# EAGLE design lego dc converter (EAGLE 5.12)
BOM: EXCLUDE; DATABASE: ../../partsdb.txt; PARTNO: CRGH1206J470K
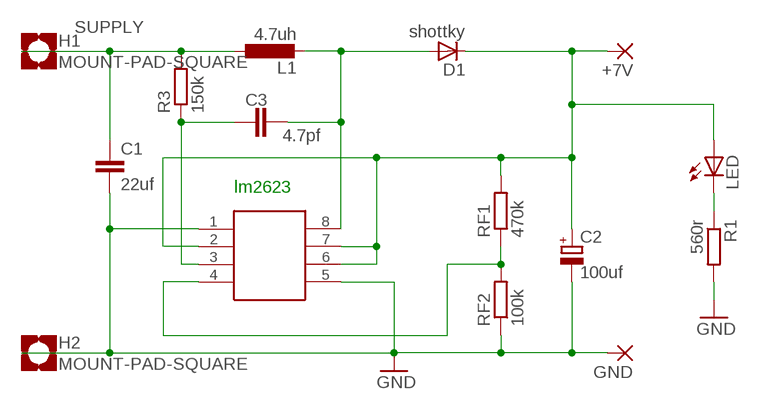
[diagram p0: schematic, sheet 1]

## Parts
+7V  3,17/1,1  [3,17/1,1]
C1  22uf  C-EUC1206  [C1206]
C2  100uf  CPOL-EUC/6032-28R  [C/6032-28R]
C3  4.7pf  C-EUC1206  [C1206]
D1  shottky  BYS10  [SOD106A]
GND  3,17/1,1  [3,17/1,1]
H1  MOUNT-PAD-SQUARE  [FUELCELL]
H2  MOUNT-PAD-SQUARE  [FUELCELL]
L1  4.7uh  L-EUL5050  [L5050]
LED  LEDSMT1206  [1206]
LM2623  lm2623  MINI-SO  [MINI-SO]
R1  560r  R-EU_M1206  [M1206]
R3  150k  R-EU_M1206  [M1206]
RF1  470k  R-EU_M1206  [M1206]
RF2  100k  R-EU_M1206  [M1206]

## Nets
GND: C1.2 C2.- GND.1(P) H2.P$1(MOUNT) LM2623.1 LM2623.5 R1.2 RF2.1
N$1: C3.1 LM2623.3 R3.1
N$3: LM2623.4 RF1.1 RF2.2
N$16: LED.C R1.1
OUT [supply]: +7V.1(P) C2.+ D1.K LED.A LM2623.2 LM2623.6 LM2623.7 RF1.2
SUPPLY: C1.1 H1.P$1(MOUNT) L1.1 R3.2
SWITCH [supply]: C3.2 D1.A L1.2 LM2623.8

## Notes on the sheet
- lm2623

## Library data of the parts
+7V GND = wirepad:3,17/1,1: THROUGH-HOLE PAD
C1 = resistor:C-EU: CAPACITOR, European symbol
C2 = rcl:CPOL-EU: POLARIZED CAPACITOR, European symbol
C3 = matt rcl:C-EU: CAPACITOR, European symbol
D1 = telefunken:BYS10: DIODE
H1 H2 = holes:MOUNT-PAD-SQUARE: MOUNTING PAD, square
L1 = matt rcl:L-EU: INDUCTOR, European symbol
LED = matt led:LED: LED OSRAM: - CHIPLED LG R971, LG N971, LY N971, LG Q971, LY Q971, LO R971, LY R971 LH N974, LH R974 LS Q976, LO Q976, LY Q976 LO Q996 - Hyper CHIPLED LW Q18S LB Q993, LB Q99A, LB R99A - SideLED LS A670, LO A670, LY A670, LG A670, LP A670 LB A673, LV A673, LT A673, LW A673 LH A674 LY A675 LS A676, LA A676, LO A676, LY A676, LW A676 LS A679, LY A679, LG A679 - Hyper Micro SIDELED® LS Y876, LA Y876, LO Y876, LY Y876 LT Y87S - SmartLED LW L88C, LW L88S LB L89C, LB L89S, LG L890 LS L89K, LO L89K, LY L89K LS L896, LA L896, LO L896, LY L896 - TOPLED LS T670, LO T670, LY T670, LG T670, LP T670 LSG T670, LSP T670, LSY T670, LOP T670, LYG T670 LG T671, LOG T671, LSG T671 LB T673, LV T673, LT T673, LW T673 LH T674 LS T676, LA T676, LO T676, LY T676, LB T676, LH T676, LSB T676, LW T676 LB T67C, LV T67C, LT T67C, LS T67K, LO T67K, LY T67K, LW E67C LS E67B, LA E67B, LO E67B, LY E67B, LB E67C, LV E67C, LT E67C LW T67C LS T679, LY T679, LG T679 LS T770, LO T770, LY T770, LG T770, LP T770 LB T773, LV T773, LT T773, LW T773 LH T774 LS E675, LA E675, LY E675, LS T675 LS T776, LA T776, LO T776, LY T776, LB T776 LHGB T686 LT T68C, LB T68C - Hyper Mini TOPLED® LB M676 - Mini TOPLED Santana® LG M470 LS M47K, LO M47K, LY M47K Source: http://www.osram.convergy.de LUXEON: - LUMILED® LXK2-PW12-R00, LXK2-PW12-S00, LXK2-PW14-U00, LXK2-PW14-V00 LXK2-PM12-R00, LXK2-PM12-S00, LXK2-PM14-U00 LXK2-PE12-Q00, LXK2-PE12-R00, LXK2-PE12-S00, LXK2-PE14-T00, LXK2-PE14-U00 LXK2-PB12-K00, LXK2-PB12-L00, LXK2-PB12-M00, LXK2-PB14-N00, LXK2-PB14-P00, LXK2-PB14-Q00 LXK2-PR12-L00, LXK2-PR12-M00, LXK2-PR14-Q00, LXK2-PR14-R00 LXK2-PD12-Q00, LXK2-PD12-R00, LXK2-PD12-S00 LXK2-PH12-R00, LXK2-PH12-S00 LXK2-PL12-P00, LXK2-PL12-Q00, LXK2-PL12-R00 Source: www.luxeon.com KINGBRIGHT: KA-3528ASYC Source: www.kingbright.com
LM2623 = matt smd-special:MINI-SO: Mini-SO generic format
R1 R3 RF1 RF2 = resistor:R-EU_: RESISTOR, European symbol

## Net classes
1 supply: width 0.508 mm

## Board
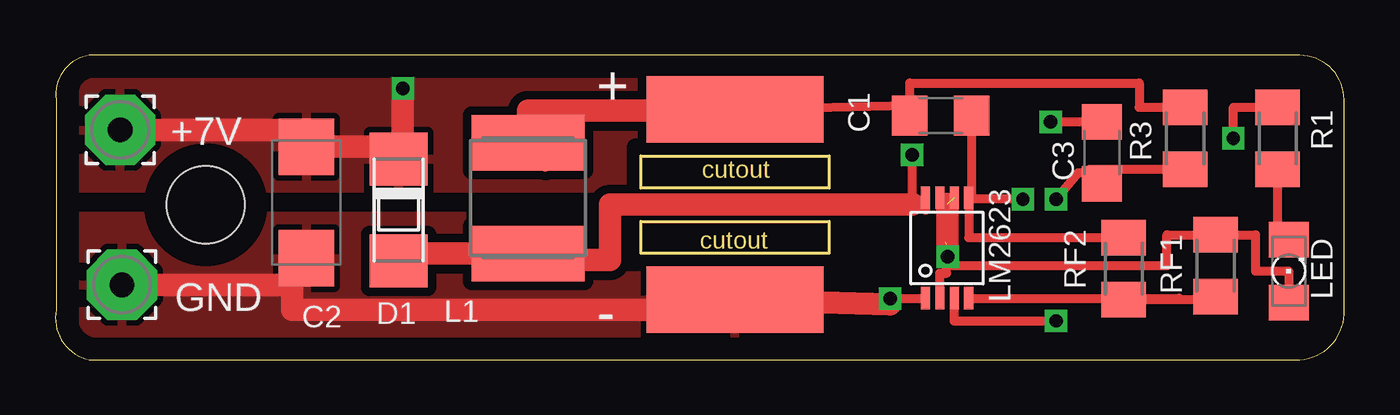
[diagram p1: board, top side]
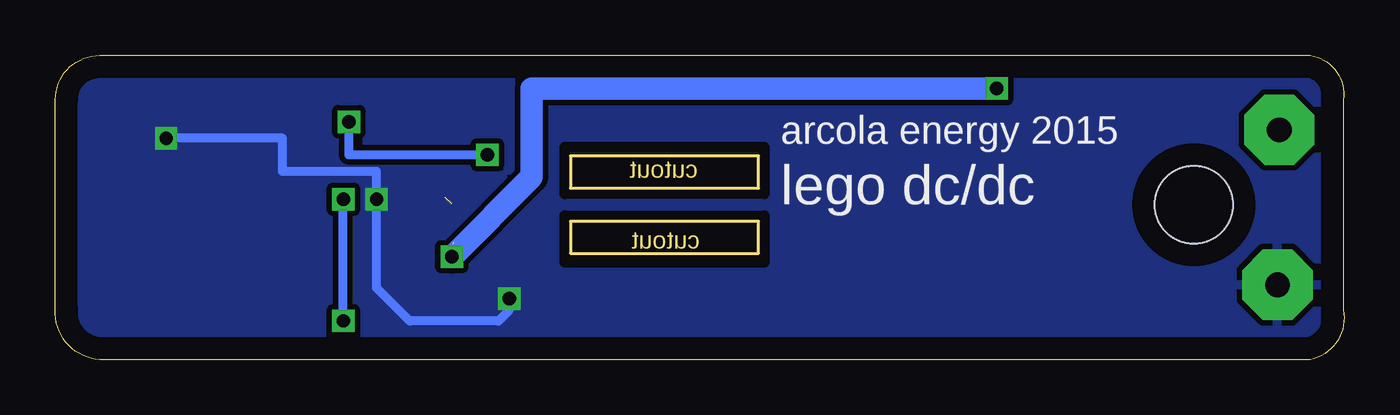
[diagram p2: board, bottom side, seen from below]

Size 58.19 x 13.75 mm. Coordinates in mm from the lower left corner, seen from the top.
Outline: 58.19,11.75 arc90 56.19,13.75 1.54,13.75 arc90 0.04,11.75 0.04,2.25 arc90 1.54,0 56.19,0 arc90 58.19,2.25 58.19,11.75
Copper layers (1*16): Top 0.035mm / dielectric 1.5mm / Bottom 0.035mm
Design rules "default": minimum track width 10mil, minimum drill 24mil, track to track 8mil, track to pad 8mil, pad to pad 8mil, via to via 8mil, smd to smd 8mil, copper to edge 40mil, drill to drill 8mil, minimum pad ring 10mil, minimum via ring 8mil, stop-mask expansion 4mil, vias tented up to drill 0mil, thermal gap 10mil
Holes 3.5 mm at 6.79,7
vRestrict: area 17.2,1.8 to 25.2,12.2

### Footprints (pad centres in the part's own frame; a part is rotated, then mirrored left to right if it is on the bottom)
3,17/1,1 = drill 1.118 pad 3.175 octagon: 1 0,0
C1206 = smd 1.6 x 1.8: 1 -1.4,0; 2 1.4,0
C/6032-28R = smd 2.55 x 2.5: + 2.525,0; - -2.525,0
SOD106A = smd 2.4 x 2.6: A 2.3,0; K -2.3,0
FUELCELL = smd 8 x 3: P$1 0,1.8
L5050 = smd 2.5 x 5.1: 1 -1.5,0; 2 3.5,0
1206 = smd 1.6 x 1.803: A -1.422,0; C 1.422,0
MINI-SO = smd 1.02 x 0.41: 1 0,0; 2 0,-0.65; 3 0,-1.3; 4 0,-1.95; 5 4.55,-1.95; 6 4.55,-1.3; 7 4.55,-0.65; 8 4.55,0
M1206 = smd 1.6 x 2: 1 -1.4,0; 2 1.4,0

### Placement (x,y rotation side)
+7V  2.93,10.38 0 top
C1  39.98,11.03 0 top
C2  11.34,7.1 90 top
C3  47.26,9.35 90 top
D1  15.5,6.76 270 top
GND  3.01,3.38 0 top
H1  30.69,9.5 0 top
H2  30.69,4.5 180 top
L1  21.34,8.29 270 top
LED  55.69,4 90 top
LM2623  39.29,2.77 90 top
R1  55.19,10 90 top
R3  51.01,10 90 top
RF1  52.39,4.24 90 top
RF2  48.24,4.11 270 top

### Tracks (layer width: path | path; a pad name or v marks a point on that pad's centre or on a via)
GND  (via drill 0.6)
  Top 0.406: 30.69,2.25 H2.P$1 | 37.77,2.75 LM2623.1 37.71,2.77 v37.69,2.75 | LM2623.5 41.38,7.32 C1.2 | RF2.1 41.24,5.51 LM2623.5 | v43.69,7.25 41.31,7.25 LM2623.5 | R1.2 53.19,11.4 v53.19,10
  Top 1.016: 10.69,3.38 10.69,4.57 | 30.69,2.25 10.69,2.25 10.69,3.38 | H2.P$1 37.69,2.5 v37.69,2.75 | GND.1 10.69,3.38
  Bottom 0.406: v37.69,2.75 37.69,2.25 38.19,1.75 42.19,1.75 43.69,3.25 v43.69,7.25 43.69,8.5 47.94,8.5 47.94,10 v53.19,10
  pour Bottom (isolate 0.25): 0.04,13.5 56.19,13.75 arc-90 58.19,11.75 58.19,0.25 1.54,0.25 arc-90 0.04,2
  pour Top (isolate 0.4): 0.29,6.5 33.69,6.5 33.69,0.5 0.29,0.5
N$1  (via drill 0.6)
  Top 0.406: 46.69,8.45 46.19,8.45 v45.19,7.25 | 46.69,8.45 C3.1 | v45.19,1.75 40.59,1.75 LM2623.3 | R3.1 46.69,8.6 46.69,8.45
  Bottom 0.406: v45.19,1.75 v45.19,7.25
N$3
  Top 0.406: LM2623.4 50.74,2.77 RF2.2 52.14,2.71 RF1.1
N$16
  Top 0.406: LED.C 55.19,5.42 R1.1
OUT  (via drill 0.6)  (2 unrouted)
  Top 0.406: 15.5,9.37 D1.K 15.69,9.06 | 40.29,6.55 40.24,5.2 40.24,3.9 39.94,3.9 LM2623.2 | 40.19,5.32 v40.29,4.65 40.19,4.25 50.19,4.25 50.19,5.64 RF1.2 54.19,5.64 54.19,4 55.69,4 LED.A | 40.29,7.02 LM2623.7
  Top 1.016: 15.69,9.06 v15.69,12.25 | v40.29,4.65 40.29,7.02 | +7V.1 11.34,10.38 C2.+ 15.5,9.62 D1.K
  Bottom 1.016: v40.29,4.65 36.69,8.25 36.69,12.25 v15.69,12.25
  pour Top (isolate 0.4): 0.29,7.75 34.69,7.75 34.69,12.75 0.29,12.75
SUPPLY
  Top 0.406: L1.1 22.13,8.69 | 38.58,11.5 38.58,12.5 48.94,12.5 48.94,11.4 R3.2 | H1.P$1 38.58,11.5 | 38.58,11.5 C1.1
  Top 1.016: H1.P$1 30.69,11.25 21.34,11.25 L1.1
SWITCH  (via drill 0.6)
  Top 0.406: D1.A 15.53,4.49 | 39.29,6.75 LM2623.8 38.69,7.02 | 38.69,7 v38.69,9.25 | v44.94,10.75 C3.2 | 22.94,4.5 21.25,4.5 L1.2
  Top 1.016: 38.69,7.02 38.69,7 25.04,7 25.04,4.5 22.94,4.5 | L1.2 15.5,4.79 D1.A
  Bottom 0.406: v38.69,9.25 44.94,9.25 v44.94,10.75

### Text on the board
tNames: + | -
bNames: arcola energy 2015 | lego dc/dc